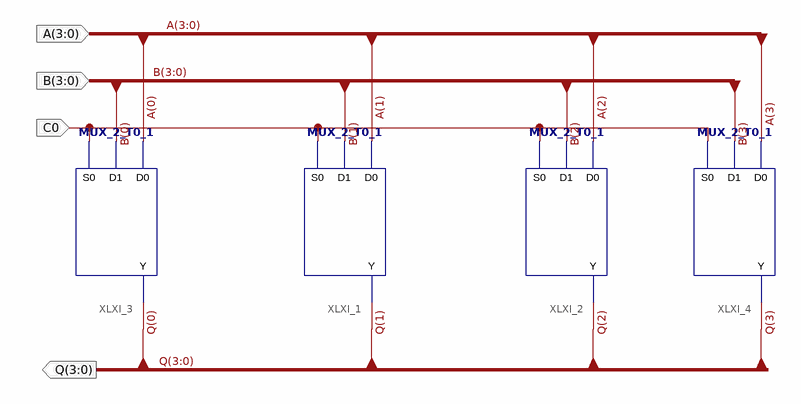
[diagram p0: schematic sheet 1]
// Xilinx ISE schematic MUX_2_4.sch (spartan3e) as structural Verilog: 4 symbols, 4 ports
module MUX_2_4 (
  input  [3:0] A,
  input  [3:0] B,
  input  C0,
  output [3:0] Q
);

  MUX_2_T0_1 XLXI_1 (.D0(A[1]), .D1(B[1]), .S0(C0), .Y(Q[1]));
  MUX_2_T0_1 XLXI_2 (.D0(A[2]), .D1(B[2]), .S0(C0), .Y(Q[2]));
  MUX_2_T0_1 XLXI_3 (.D0(A[0]), .D1(B[0]), .S0(C0), .Y(Q[0]));
  MUX_2_T0_1 XLXI_4 (.D0(A[3]), .D1(B[3]), .S0(C0), .Y(Q[3]));
endmodule
